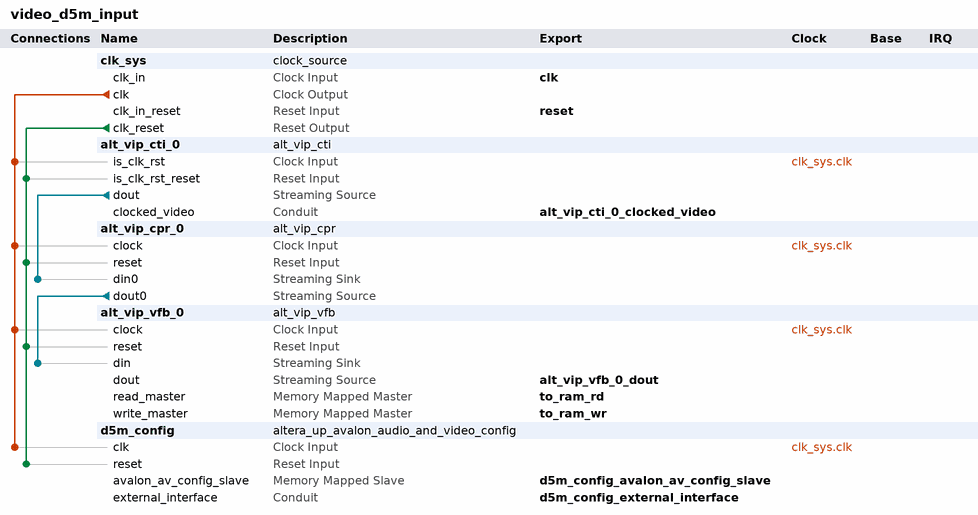
[diagram p0: system contents]
# Platform Designer (Qsys) system video_d5m_input, Cyclone V 5CGXFC5C6F27C7
# Parameters at their usual value, and those the tool derives, are not listed.
package require -exact qsys 18.1
create_system video_d5m_input
set_project_property DEVICE_FAMILY {Cyclone V}
set_project_property DEVICE 5CGXFC5C6F27C7

add_instance clk_sys clock_source 18.1
set_instance_parameter_value clk_sys clockFrequency 100000000
set_instance_parameter_value clk_sys clockFrequencyKnown false
set_instance_parameter_value clk_sys resetSynchronousEdges DEASSERT

add_instance alt_vip_cti_0 alt_vip_cti 14.0
set_instance_parameter_value alt_vip_cti_0 ACCEPT_COLOURS_IN_SEQ 0
set_instance_parameter_value alt_vip_cti_0 ADD_DATA_ENABLE_SIGNAL 0
set_instance_parameter_value alt_vip_cti_0 BPS 8
set_instance_parameter_value alt_vip_cti_0 CLOCKS_ARE_SAME 0
set_instance_parameter_value alt_vip_cti_0 COLOUR_PLANES_ARE_IN_PARALLEL 1
set_instance_parameter_value alt_vip_cti_0 FAMILY {Cyclone V}
set_instance_parameter_value alt_vip_cti_0 FIFO_DEPTH 1920
set_instance_parameter_value alt_vip_cti_0 GENERATE_ANC 0
set_instance_parameter_value alt_vip_cti_0 GENERATE_SYNC 0
set_instance_parameter_value alt_vip_cti_0 H_ACTIVE_PIXELS_F0 1920
set_instance_parameter_value alt_vip_cti_0 INTERLACED 0
set_instance_parameter_value alt_vip_cti_0 NUMBER_OF_COLOUR_PLANES 3
set_instance_parameter_value alt_vip_cti_0 STD_WIDTH 1
set_instance_parameter_value alt_vip_cti_0 SYNC_TO 2
set_instance_parameter_value alt_vip_cti_0 USE_CONTROL 0
set_instance_parameter_value alt_vip_cti_0 USE_EMBEDDED_SYNCS 0
set_instance_parameter_value alt_vip_cti_0 USE_STD 0
set_instance_parameter_value alt_vip_cti_0 V_ACTIVE_LINES_F0 1080
set_instance_parameter_value alt_vip_cti_0 V_ACTIVE_LINES_F1 32

add_instance alt_vip_cpr_0 alt_vip_cpr 13.1
set_instance_parameter_value alt_vip_cpr_0 DIN0_SYMBOLS_PER_BEAT 3
set_instance_parameter_value alt_vip_cpr_0 DIN1_ENABLED 0
set_instance_parameter_value alt_vip_cpr_0 DIN1_SYMBOLS_PER_BEAT 0
set_instance_parameter_value alt_vip_cpr_0 DOUT0_SYMBOLS_PER_BEAT 3
set_instance_parameter_value alt_vip_cpr_0 DOUT1_ENABLED 0
set_instance_parameter_value alt_vip_cpr_0 DOUT1_SYMBOLS_PER_BEAT 0
set_instance_parameter_value alt_vip_cpr_0 PARAMETERISATION {<colourPatternRearrangerParams><CPR_NAME>Color Plane Sequencer</CPR_NAME><CPR_BPS>8</CPR_BPS><CPR_PORTS><INPUT_PORT><NAME>din0</NAME><STREAMING_DESCRIPTOR>[B:G:R]</STREAMING_DESCRIPTOR><ENABLED>true</ENABLED></INPUT_PORT><INPUT_PORT><NAME>din1</NAME><STREAMING_DESCRIPTOR>[Channel]</STREAMING_DESCRIPTOR><ENABLED>false</ENABLED></INPUT_PORT><OUTPUT_PORT><NAME>dout0</NAME><STREAMING_DESCRIPTOR>[B:G:R]</STREAMING_DESCRIPTOR><ENABLED>true</ENABLED><NON_IMAGE_PACKET_SOURCE>din0</NON_IMAGE_PACKET_SOURCE><HALVE_WIDTH>false</HALVE_WIDTH></OUTPUT_PORT><OUTPUT_PORT><NAME>dout1</NAME><STREAMING_DESCRIPTOR>[Channel]</STREAMING_DESCRIPTOR><ENABLED>false</ENABLED><NON_IMAGE_PACKET_SOURCE>din0</NON_IMAGE_PACKET_SOURCE><HALVE_WIDTH>false</HALVE_WIDTH></OUTPUT_PORT></CPR_PORTS><CPR_INPUT_2_PIXELS>false</CPR_INPUT_2_PIXELS></colourPatternRearrangerParams>}

add_instance alt_vip_vfb_0 alt_vip_vfb 13.1

add_instance d5m_config altera_up_avalon_audio_and_video_config 18.0
set_instance_parameter_value d5m_config audio_in {Microphone to ADC}
set_instance_parameter_value d5m_config bit_length 24
set_instance_parameter_value d5m_config board DE1-SoC
set_instance_parameter_value d5m_config d5m_resolution {1920 x 1080}
set_instance_parameter_value d5m_config line_in_bypass false
set_instance_parameter_value d5m_config sampling_rate {48 kHz}

# connections
add_connection clk_sys.clk alt_vip_cpr_0.clock clock
add_connection clk_sys.clk alt_vip_cti_0.is_clk_rst clock
add_connection clk_sys.clk alt_vip_vfb_0.clock clock
add_connection clk_sys.clk d5m_config.clk clock
add_connection clk_sys.clk_reset alt_vip_cpr_0.reset reset
add_connection clk_sys.clk_reset alt_vip_cti_0.is_clk_rst_reset reset
add_connection clk_sys.clk_reset alt_vip_vfb_0.reset reset
add_connection clk_sys.clk_reset d5m_config.reset reset
add_connection alt_vip_cpr_0.dout0 alt_vip_vfb_0.din avalon_streaming
add_connection alt_vip_cti_0.dout alt_vip_cpr_0.din0 avalon_streaming

# exported interfaces
add_interface alt_vip_cti_0_clocked_video conduit end
set_interface_property alt_vip_cti_0_clocked_video EXPORT_OF alt_vip_cti_0.clocked_video
add_interface alt_vip_vfb_0_dout avalon_streaming source
set_interface_property alt_vip_vfb_0_dout EXPORT_OF alt_vip_vfb_0.dout
add_interface clk clock sink
set_interface_property clk EXPORT_OF clk_sys.clk_in
add_interface d5m_config_avalon_av_config_slave avalon slave
set_interface_property d5m_config_avalon_av_config_slave EXPORT_OF d5m_config.avalon_av_config_slave
add_interface d5m_config_external_interface conduit end
set_interface_property d5m_config_external_interface EXPORT_OF d5m_config.external_interface
add_interface reset reset sink
set_interface_property reset EXPORT_OF clk_sys.clk_in_reset
add_interface to_ram_rd avalon master
set_interface_property to_ram_rd EXPORT_OF alt_vip_vfb_0.read_master
add_interface to_ram_wr avalon master
set_interface_property to_ram_wr EXPORT_OF alt_vip_vfb_0.write_master

set_interconnect_requirement {$system} qsys_mm.clockCrossingAdapter AUTO
set_interconnect_requirement {$system} qsys_mm.maxAdditionalLatency 4

save_system video_d5m_input.qsys
